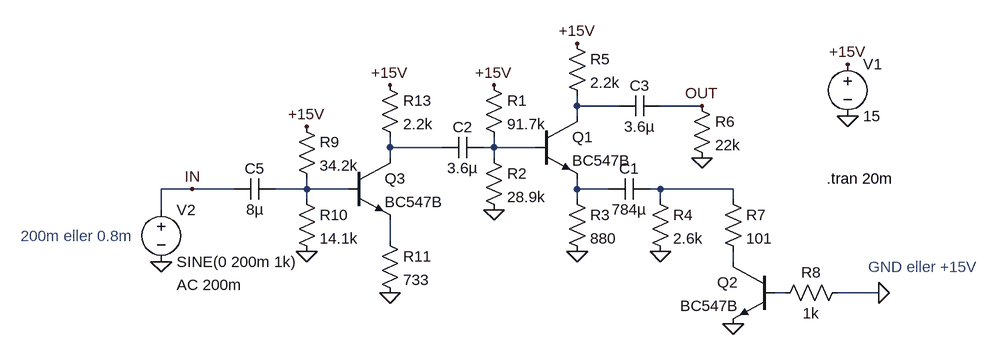
[diagram p0: schematic diagram.asc]
diagram.asc, the LTspice schematic file:
Version 4
SHEET 1 888 680
WIRE 176 64 176 48
WIRE 240 64 176 64
WIRE 368 64 304 64
WIRE 176 80 176 64
WIRE -112 128 -112 112
WIRE -32 128 -112 128
WIRE 48 128 48 112
WIRE 48 128 32 128
WIRE 112 128 48 128
WIRE -112 144 -112 128
WIRE 48 144 48 128
WIRE -416 192 -464 192
WIRE -352 192 -416 192
WIRE -240 192 -240 176
WIRE -240 192 -288 192
WIRE -176 192 -240 192
WIRE 176 192 176 176
WIRE 224 192 176 192
WIRE 304 192 288 192
WIRE 416 192 304 192
WIRE -240 208 -240 192
WIRE 176 208 176 192
WIRE 304 208 304 192
WIRE 416 208 416 192
WIRE -464 224 -464 192
WIRE -112 272 -112 240
WIRE 416 304 416 288
WIRE 496 352 480 352
WIRE 640 352 576 352
FLAG 48 224 0
FLAG 304 288 0
FLAG 176 288 0
FLAG 48 32 +15V
FLAG 176 -32 +15V
FLAG 592 0 +15V
FLAG 592 80 0
FLAG -464 304 0
FLAG 368 144 0
FLAG 368 64 OUT
FLAG -416 192 IN
FLAG 416 400 0
FLAG -240 288 0
FLAG -112 352 0
FLAG -240 96 +15V
FLAG -112 32 +15V
FLAG 640 352 0
SYMBOL res 32 16 R0
SYMATTR InstName R1
SYMATTR Value 91.7k
SYMBOL res 32 128 R0
SYMATTR InstName R2
SYMATTR Value 28.9k
SYMBOL res 160 192 R0
SYMATTR InstName R3
SYMATTR Value 880
SYMBOL res 288 192 R0
SYMATTR InstName R4
SYMATTR Value 2.6k
SYMBOL res 160 -48 R0
SYMATTR InstName R5
SYMATTR Value 2.2k
SYMBOL npn 112 80 R0
SYMATTR InstName Q1
SYMATTR Value BC547B
SYMBOL cap 288 176 R90
WINDOW 0 0 32 VBottom 0
WINDOW 3 32 32 VTop 0
SYMATTR InstName C1
SYMATTR Value 784µ
SYMBOL voltage 592 -16 R0
WINDOW 123 0 0 Left 0
WINDOW 39 0 0 Left 0
SYMATTR InstName V1
SYMATTR Value 15
SYMBOL voltage -464 208 R0
WINDOW 123 24 132 Left 0
WINDOW 39 0 0 Left 0
SYMATTR Value2 AC 200m
SYMATTR InstName V2
SYMATTR Value SINE(0 200m 1k)
SYMBOL cap 32 112 R90
WINDOW 0 0 32 VBottom 0
WINDOW 3 32 32 VTop 0
SYMATTR InstName C2
SYMATTR Value 3.6µ
SYMBOL cap 304 48 R90
WINDOW 0 0 32 VBottom 0
WINDOW 3 32 32 VTop 0
SYMATTR InstName C3
SYMATTR Value 3.6µ
SYMBOL res 352 48 R0
SYMATTR InstName R6
SYMATTR Value 22k
SYMBOL res 400 192 R0
SYMATTR InstName R7
SYMATTR Value 101
SYMBOL npn 480 304 M0
SYMATTR InstName Q2
SYMATTR Value BC547B
SYMBOL res 592 336 R90
WINDOW 0 0 56 VBottom 0
WINDOW 3 32 56 VTop 0
SYMATTR InstName R8
SYMATTR Value 1k
SYMBOL res -256 80 R0
SYMATTR InstName R9
SYMATTR Value 34.2k
SYMBOL res -256 192 R0
SYMATTR InstName R10
SYMATTR Value 14.1k
SYMBOL res -128 256 R0
SYMATTR InstName R11
SYMATTR Value 733
SYMBOL res -128 16 R0
SYMATTR InstName R13
SYMATTR Value 2.2k
SYMBOL npn -176 144 R0
SYMATTR InstName Q3
SYMATTR Value BC547B
SYMBOL cap -288 176 R90
WINDOW 0 0 32 VBottom 0
WINDOW 3 32 32 VTop 0
SYMATTR InstName C5
SYMATTR Value 8µ
TEXT 560 176 Left 0 !.tran 20m
TEXT 624 312 Left 0 ;GND eller +15V
TEXT -680 264 Left 0 ;200m eller 0.8m

The netlist it stands for:
* diagram.asc
R1 +15V N003 91.7k
R2 N003 0 28.9k
R3 N005 0 880
R4 N006 0 2.6k
R5 +15V N001 2.2k
Q1 N001 N003 N005 0 BC547B
C1 N006 N005 784µ
V1 +15V 0 15
V2 IN 0 SINE(0 200m 1k) AC 200m
C2 N003 N002 3.6µ
C3 OUT N001 3.6µ
R6 OUT 0 22k
R7 N006 N008 101
Q2 N008 N009 0 0 BC547B
R8 0 N009 1k
R9 +15V N004 34.2k
R10 N004 0 14.1k
R11 N007 0 733
R13 +15V N002 2.2k
Q3 N002 N004 N007 0 BC547B
C5 N004 IN 8µ
.model NPN NPN
.model PNP PNP
.lib standard.bjt
.tran 20m
* GND eller +15V
* 200m eller 0.8m
.backanno
.end